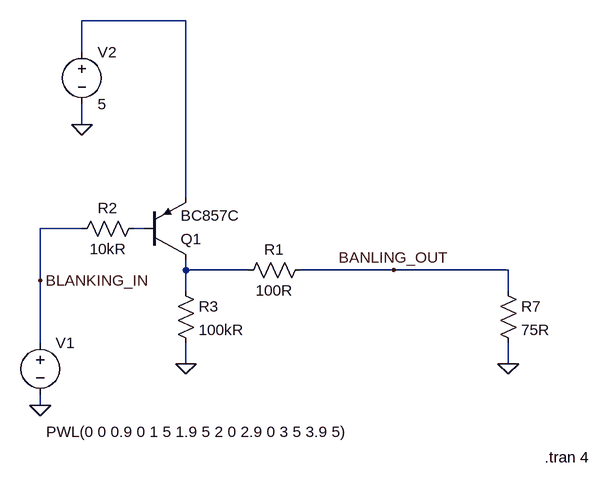
[diagram p0: schematic BLANKING_output_circuit.asc]
BLANKING_output_circuit.asc, the LTspice schematic file:
Version 4
SHEET 1 1620 784
WIRE 192 96 32 96
WIRE 32 144 32 96
WIRE 32 256 32 224
WIRE 192 368 192 96
WIRE 32 416 -32 416
WIRE 128 416 112 416
WIRE 192 480 192 464
WIRE 288 480 192 480
WIRE 512 480 368 480
WIRE 688 480 512 480
WIRE -32 496 -32 416
WIRE 192 512 192 480
WIRE 688 512 688 480
WIRE -32 592 -32 496
WIRE 192 624 192 592
WIRE 688 624 688 592
WIRE -32 688 -32 672
FLAG 32 256 0
FLAG -32 496 BLANKING_IN
FLAG -32 688 0
FLAG 688 624 0
FLAG 512 480 BANLING_OUT
FLAG 192 624 0
SYMBOL res 128 400 R90
WINDOW 0 0 56 VBottom 2
WINDOW 3 32 56 VTop 2
SYMATTR InstName R2
SYMATTR Value 10kR
SYMBOL voltage 32 128 R0
WINDOW 123 0 0 Left 0
WINDOW 39 0 0 Left 0
SYMATTR InstName V2
SYMATTR Value 5
SYMBOL voltage -32 576 R0
WINDOW 3 9 153 Left 2
WINDOW 123 0 0 Left 0
WINDOW 39 0 0 Left 0
SYMATTR Value PWL(0 0 0.9 0 1 5 1.9 5 2 0 2.9 0 3 5 3.9 5)
SYMATTR InstName V1
SYMBOL res 672 496 R0
SYMATTR InstName R7
SYMATTR Value 75R
SYMBOL pnp 128 464 M180
SYMATTR InstName Q1
SYMATTR Value BC857C
SYMBOL res 384 464 R90
WINDOW 0 0 56 VBottom 2
WINDOW 3 32 56 VTop 2
SYMATTR InstName R1
SYMATTR Value 100R
SYMBOL res 176 496 R0
SYMATTR InstName R3
SYMATTR Value 100kR
TEXT 744 768 Left 2 !.tran 4

The netlist it stands for:
* BLANKING_output_circuit.asc
R2 N002 BLANKING_IN 10kR
V2 N001 0 5
V1 BLANKING_IN 0 PWL(0 0 0.9 0 1 5 1.9 5 2 0 2.9 0 3 5 3.9 5)
R7 BANLING_OUT 0 75R
Q1 N003 N002 N001 0 BC857C
R1 BANLING_OUT N003 100R
R3 N003 0 100kR
.model NPN NPN
.model PNP PNP
.lib standard.bjt
.tran 4
.backanno
.end